# Altium project crossBarNIPCB_Project2.PrjPCB
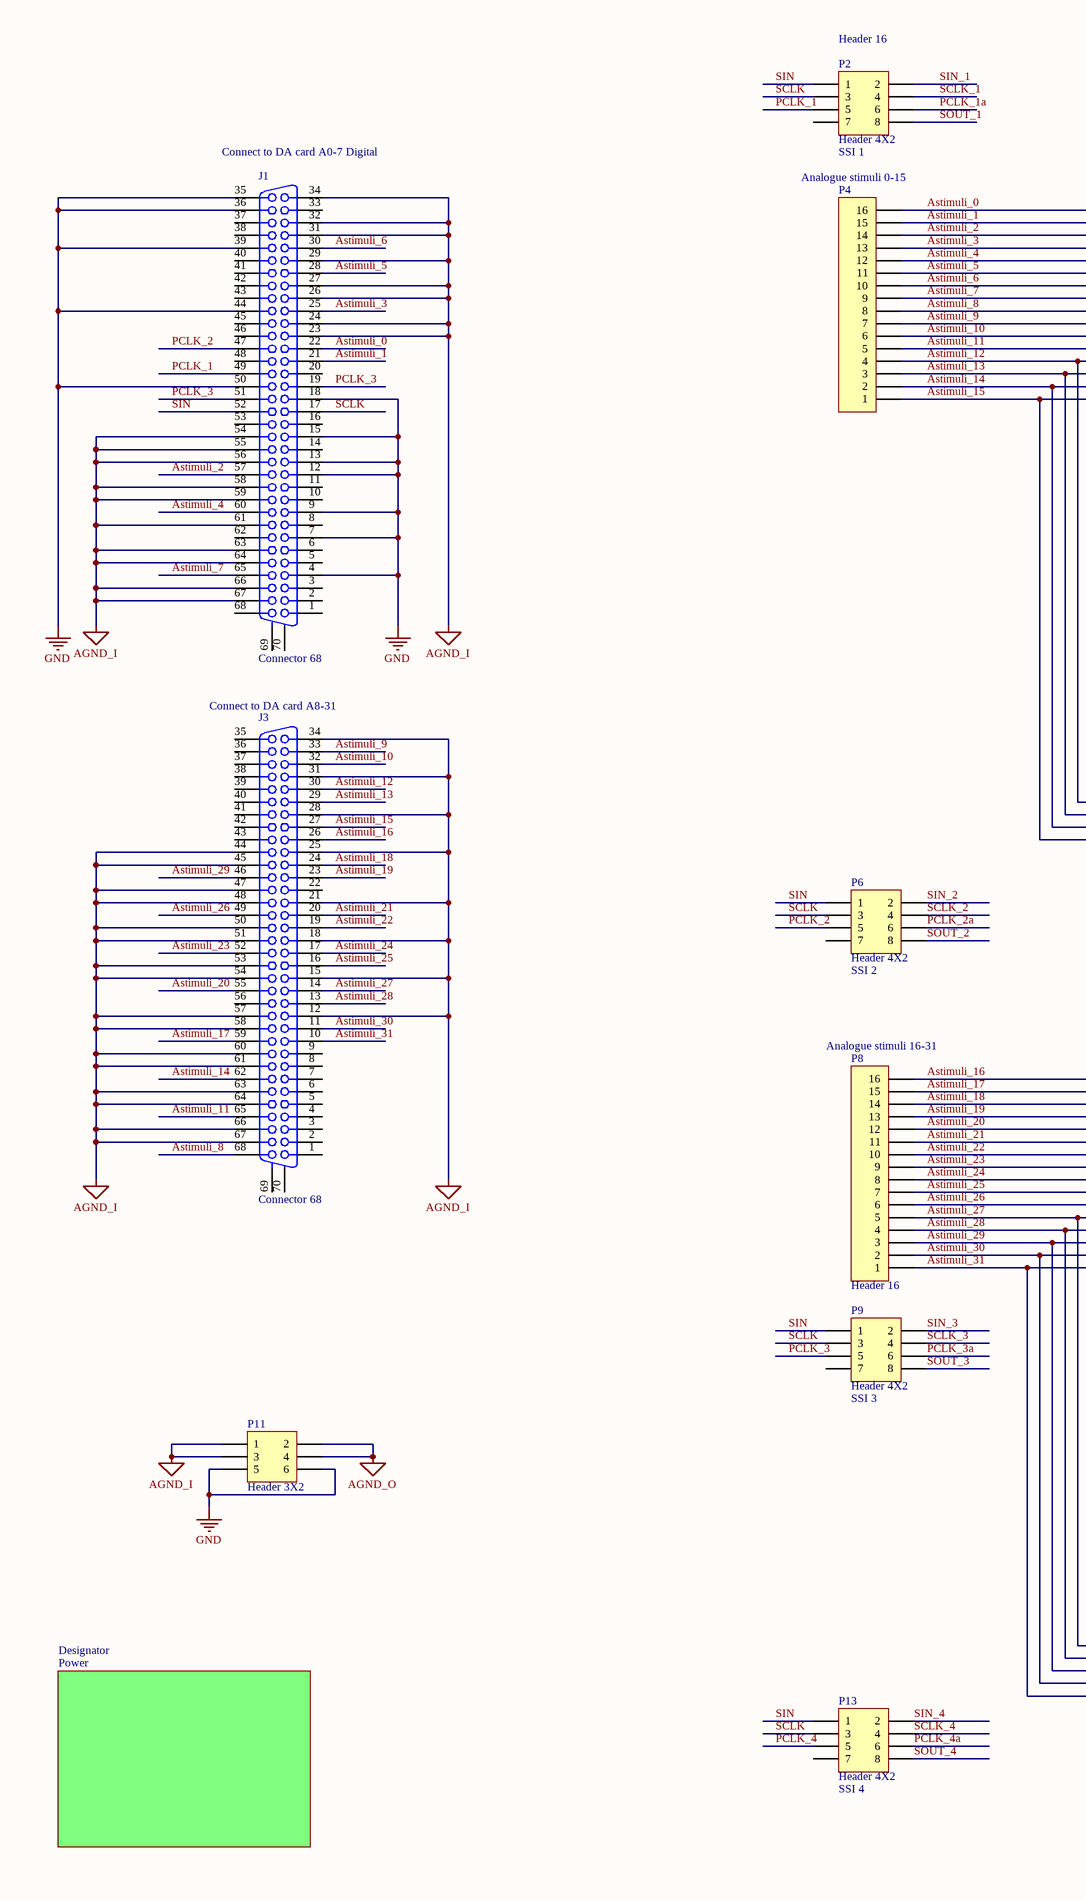
[diagram p0: Sheet1.SchDoc, left]
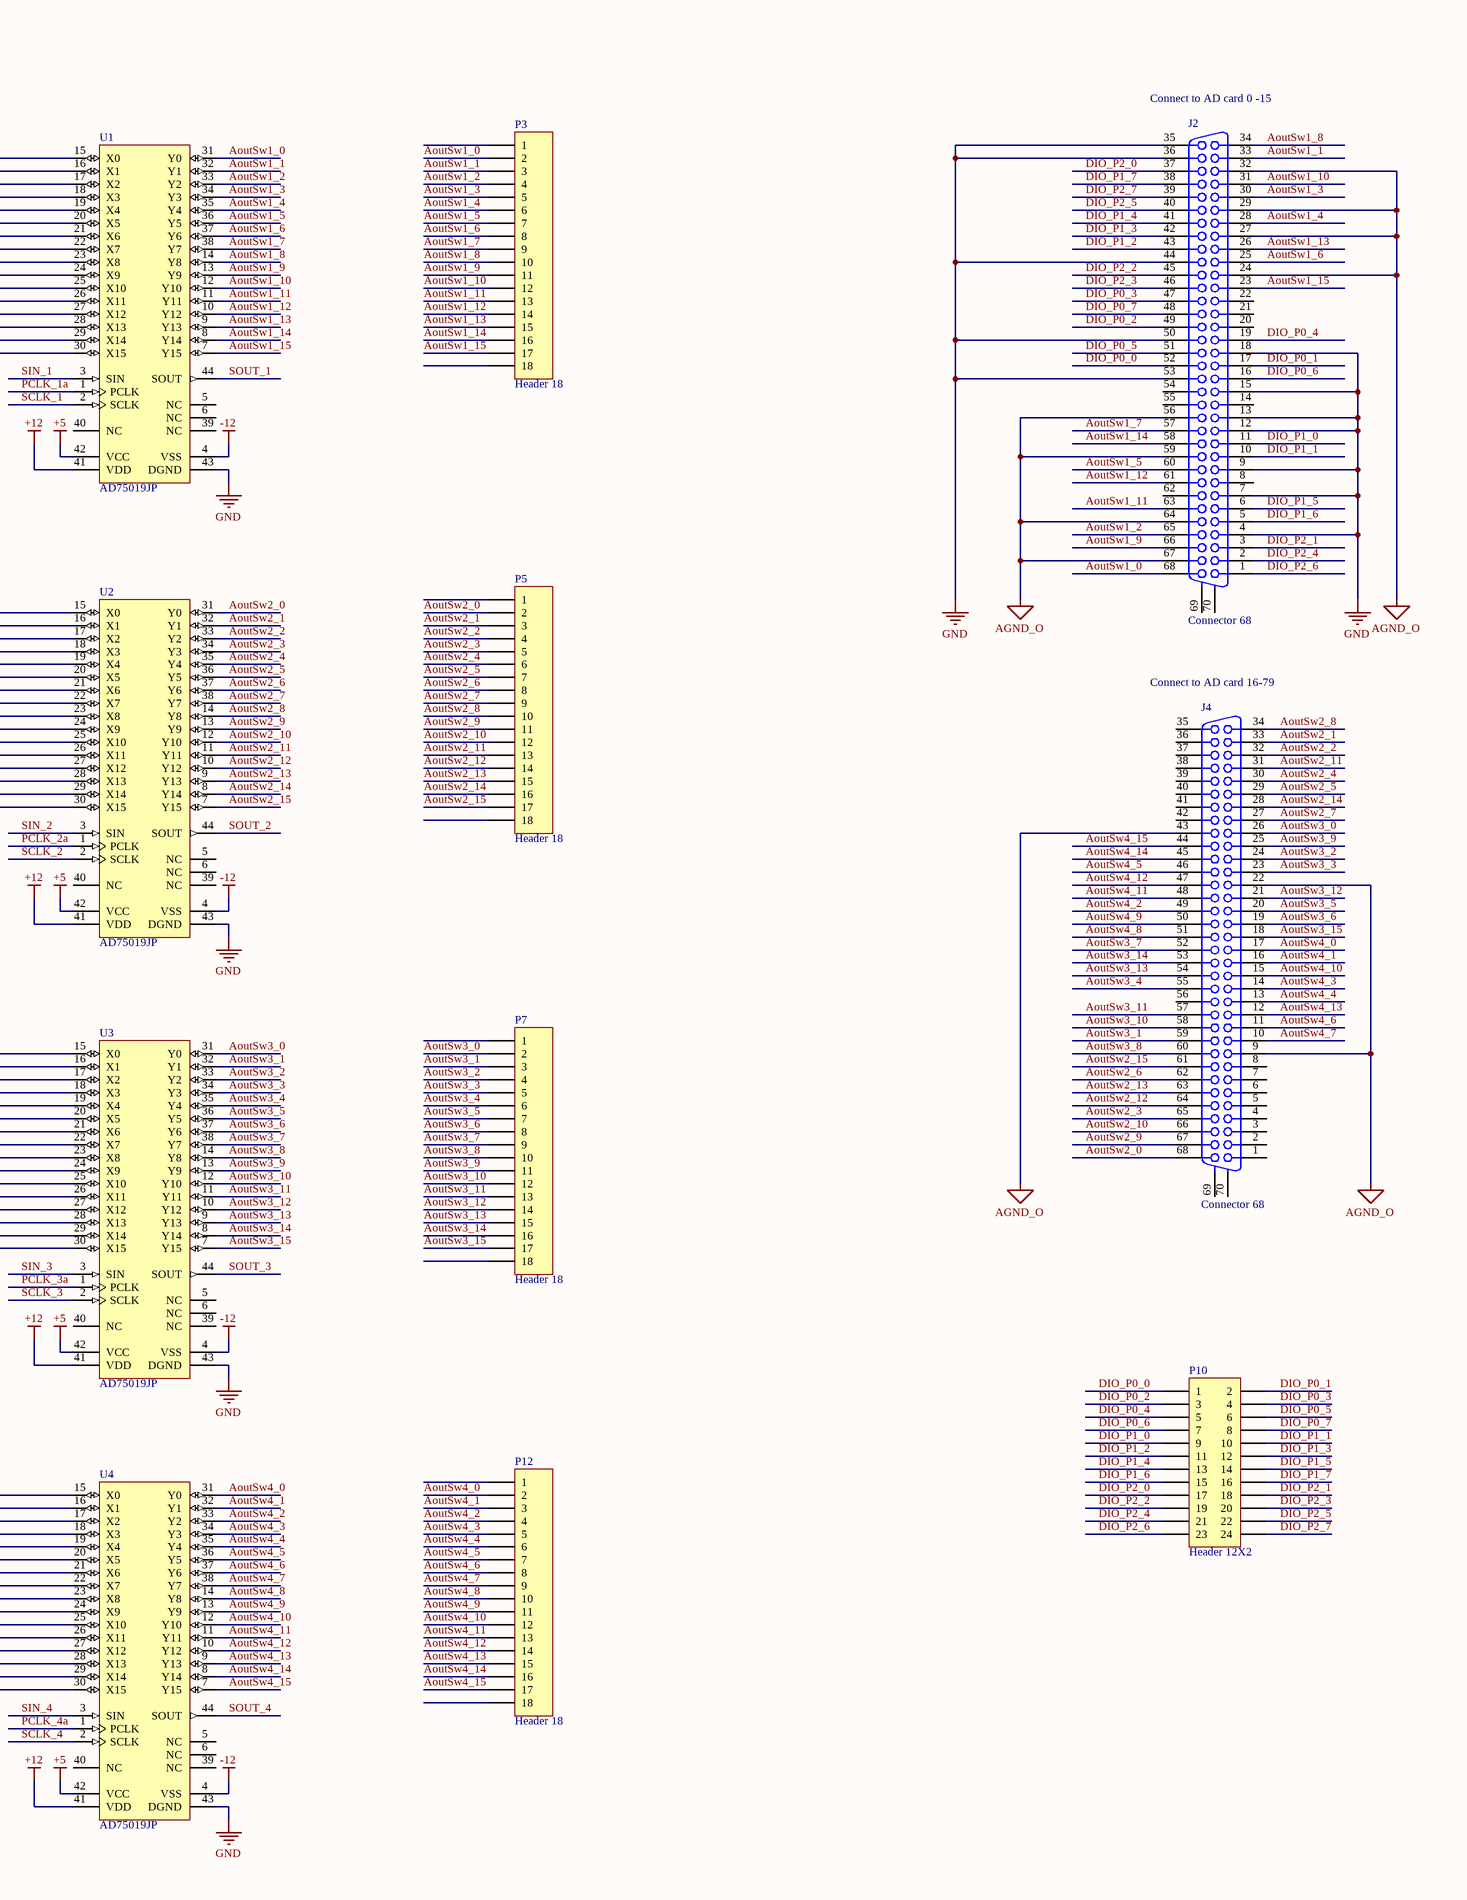
[diagram p1: Sheet1.SchDoc, right]
2 sheets, 41 parts. Net scope: global (net labels, ports and power ports of the same name join across sheets).
Board file: crossbarNI_PCB1.PcbDoc
Sheets:
  Sheet1.SchDoc
    Designator = Power.SchDoc

## Sheet Sheet1.SchDoc
size A2

### Parts
J1  Connector 68  [CHAMP1.27-2H68]
J2  Connector 68  [CHAMP1.27-2H68]
J3  Connector 68  [CHAMP1.27-2H68]
J4  Connector 68  [CHAMP1.27-2H68]
P2  Header 4X2  [HDR2X4]
P3  Header 18  [HDR1X18]
P4  Header 16  [HDR1X16]
P5  Header 18  [HDR1X18]
P6  Header 4X2  [HDR2X4]
P7  Header 18  [HDR1X18]
P8  Header 16  [HDR1X16]
P9  Header 4X2  [HDR2X4]
P10  Header 12X2  [HDR2X12]
P11  Header 3X2  [HDR2X3]
P12  Header 18  [HDR1X18]
P13  Header 4X2  [HDR2X4]
U1  AD75019JP  [ADI-P-44A_L]
U2  AD75019JP  [ADI-P-44A_N]
U3  AD75019JP  [ADI-P-44A_N]
U4  AD75019JP  [ADI-P-44A_N]

### Sub-sheets
Designator = Power: no entries

### Nets
+5: U1.42(VCC) U2.42(VCC) U3.42(VCC) U4.42(VCC)
+12: U1.41(VDD) U2.41(VDD) U3.41(VDD) U4.41(VDD)
-12: U1.4(VSS) U2.4(VSS) U3.4(VSS) U4.4(VSS)
AGND_I: J1.23 J1.24 J1.26 J1.27 J1.29 J1.31 J1.32 J1.34 J1.54 J1.55 J1.56 J1.58 J1.59 J1.61 J1.63 J1.64 J1.66 J1.67 J3.12 J3.15 J3.18 J3.21 J3.25 J3.28 J3.31 J3.34 J3.44 J3.45 J3.47 J3.48 J3.50 J3.51 J3.53 J3.54 J3.57 J3.58 J3.60 J3.61 J3.63 J3.64 J3.66 J3.67 P11.1 P11.3
AGND_O: J2.24 J2.27 J2.29 J2.32 J2.56 J2.59 J2.64 J2.67 J4.9 J4.22 J4.43 P11.2 P11.4
GND: J1.4 J1.7 J1.9 J1.12 J1.13 J1.15 J1.18 J1.35 J1.36 J1.39 J1.44 J1.50 J2.4 J2.7 J2.9 J2.12 J2.13 J2.15 J2.18 J2.35 J2.36 J2.44 J2.50 J2.53 P11.5 P11.6 U1.43(DGND) U2.43(DGND) U3.43(DGND) U4.43(DGND)
AoutSw1_0: J2.68 P3.2 U1.31(Y0)
AoutSw1_1: J2.33 P3.3 U1.32(Y1)
AoutSw1_2: J2.65 P3.4 U1.33(Y2)
AoutSw1_3: J2.30 P3.5 U1.34(Y3)
AoutSw1_4: J2.28 P3.6 U1.35(Y4)
AoutSw1_5: J2.60 P3.7 U1.36(Y5)
AoutSw1_6: J2.25 P3.8 U1.37(Y6)
AoutSw1_7: J2.57 P3.9 U1.38(Y7)
AoutSw1_8: J2.34 P3.10 U1.14(Y8)
AoutSw1_9: J2.66 P3.11 U1.13(Y9)
AoutSw1_10: J2.31 P3.12 U1.12(Y10)
AoutSw1_11: J2.63 P3.13 U1.11(Y11)
AoutSw1_12: J2.61 P3.14 U1.10(Y12)
AoutSw1_13: J2.26 P3.15 U1.9(Y13)
AoutSw1_14: J2.58 P3.16 U1.8(Y14)
AoutSw1_15: J2.23 P3.17 U1.7(Y15)
AoutSw2_0: J4.68 P5.2 U2.31(Y0)
AoutSw2_1: J4.33 P5.3 U2.32(Y1)
AoutSw2_2: J4.32 P5.4 U2.33(Y2)
AoutSw2_3: J4.65 P5.5 U2.34(Y3)
AoutSw2_4: J4.30 P5.6 U2.35(Y4)
AoutSw2_5: J4.29 P5.7 U2.36(Y5)
AoutSw2_6: J4.62 P5.8 U2.37(Y6)
AoutSw2_7: J4.27 P5.9 U2.38(Y7)
AoutSw2_8: J4.34 P5.10 U2.14(Y8)
AoutSw2_9: J4.67 P5.11 U2.13(Y9)
AoutSw2_10: J4.66 P5.12 U2.12(Y10)
AoutSw2_11: J4.31 P5.13 U2.11(Y11)
AoutSw2_12: J4.64 P5.14 U2.10(Y12)
AoutSw2_13: J4.63 P5.15 U2.9(Y13)
AoutSw2_14: J4.28 P5.16 U2.8(Y14)
AoutSw2_15: J4.61 P5.17 U2.7(Y15)
AoutSw3_0: J4.26 P7.2 U3.31(Y0)
AoutSw3_1: J4.59 P7.3 U3.32(Y1)
AoutSw3_2: J4.24 P7.4 U3.33(Y2)
AoutSw3_3: J4.23 P7.5 U3.34(Y3)
AoutSw3_4: J4.55 P7.6 U3.35(Y4)
AoutSw3_5: J4.20 P7.7 U3.36(Y5)
AoutSw3_6: J4.19 P7.8 U3.37(Y6)
AoutSw3_7: J4.52 P7.9 U3.38(Y7)
AoutSw3_8: J4.60 P7.10 U3.14(Y8)
AoutSw3_9: J4.25 P7.11 U3.13(Y9)
AoutSw3_10: J4.58 P7.12 U3.12(Y10)
AoutSw3_11: J4.57 P7.13 U3.11(Y11)
AoutSw3_12: J4.21 P7.14 U3.10(Y12)
AoutSw3_13: J4.54 P7.15 U3.9(Y13)
AoutSw3_14: J4.53 P7.16 U3.8(Y14)
AoutSw3_15: J4.18 P7.17 U3.7(Y15)
AoutSw4_0: J4.17 P12.2 U4.31(Y0)
AoutSw4_1: J4.16 P12.3 U4.32(Y1)
AoutSw4_2: J4.49 P12.4 U4.33(Y2)
AoutSw4_3: J4.14 P12.5 U4.34(Y3)
AoutSw4_4: J4.13 P12.6 U4.35(Y4)
AoutSw4_5: J4.46 P12.7 U4.36(Y5)
AoutSw4_6: J4.11 P12.8 U4.37(Y6)
AoutSw4_7: J4.10 P12.9 U4.38(Y7)
AoutSw4_8: J4.51 P12.10 U4.14(Y8)
AoutSw4_9: J4.50 P12.11 U4.13(Y9)
AoutSw4_10: J4.15 P12.12 U4.12(Y10)
AoutSw4_11: J4.48 P12.13 U4.11(Y11)
AoutSw4_12: J4.47 P12.14 U4.10(Y12)
AoutSw4_13: J4.12 P12.15 U4.9(Y13)
AoutSw4_14: J4.45 P12.16 U4.8(Y14)
AoutSw4_15: J4.44 P12.17 U4.7(Y15)
Astimuli_0: J1.22 P4.16 U1.15(X0) U2.15(X0)
Astimuli_1: J1.21 P4.15 U1.16(X1) U2.16(X1)
Astimuli_2: J1.57 P4.14 U1.17(X2) U2.17(X2)
Astimuli_3: J1.25 P4.13 U1.18(X3) U2.18(X3)
Astimuli_4: J1.60 P4.12 U1.19(X4) U2.19(X4)
Astimuli_5: J1.28 P4.11 U1.20(X5) U2.20(X5)
Astimuli_6: J1.30 P4.10 U1.21(X6) U2.21(X6)
Astimuli_7: J1.65 P4.9 U1.22(X7) U2.22(X7)
Astimuli_8: J3.68 P4.8 U1.23(X8) U2.23(X8)
Astimuli_9: J3.33 P4.7 U1.24(X9) U2.24(X9)
Astimuli_10: J3.32 P4.6 U1.25(X10) U2.25(X10)
Astimuli_11: J3.65 P4.5 U1.26(X11) U2.26(X11)
Astimuli_12: J3.30 P4.4 U1.27(X12) U2.27(X12)
Astimuli_13: J3.29 P4.3 U1.28(X13) U2.28(X13)
Astimuli_14: J3.62 P4.2 U1.29(X14) U2.29(X14)
Astimuli_15: J3.27 P4.1 U1.30(X15) U2.30(X15)
Astimuli_16: J3.26 P8.16 U3.15(X0) U4.15(X0)
Astimuli_17: J3.59 P8.15 U3.16(X1) U4.16(X1)
Astimuli_18: J3.24 P8.14 U3.17(X2) U4.17(X2)
Astimuli_19: J3.23 P8.13 U3.18(X3) U4.18(X3)
Astimuli_20: J3.55 P8.12 U3.19(X4) U4.19(X4)
Astimuli_21: J3.20 P8.11 U3.20(X5) U4.20(X5)
Astimuli_22: J3.19 P8.10 U3.21(X6) U4.21(X6)
Astimuli_23: J3.52 P8.9 U3.22(X7) U4.22(X7)
Astimuli_24: J3.17 P8.8 U3.23(X8) U4.23(X8)
Astimuli_25: J3.16 P8.7 U3.24(X9) U4.24(X9)
Astimuli_26: J3.49 P8.6 U3.25(X10) U4.25(X10)
Astimuli_27: J3.14 P8.5 U3.26(X11) U4.26(X11)
Astimuli_28: J3.13 P8.4 U3.27(X12) U4.27(X12)
Astimuli_29: J3.46 P8.3 U3.28(X13) U4.28(X13)
Astimuli_30: J3.11 P8.2 U3.29(X14) U4.29(X14)
Astimuli_31: J3.10 P8.1 U3.30(X15) U4.30(X15)
DIO_P0_0: J2.52 P10.1
DIO_P0_1: J2.17 P10.2
DIO_P0_2: J2.49 P10.3
DIO_P0_3: J2.47 P10.4
DIO_P0_4: J2.19 P10.5
DIO_P0_5: J2.51 P10.6
DIO_P0_6: J2.16 P10.7
DIO_P0_7: J2.48 P10.8
DIO_P1_0: J2.11 P10.9
DIO_P1_1: J2.10 P10.10
DIO_P1_2: J2.43 P10.11
DIO_P1_3: J2.42 P10.12
DIO_P1_4: J2.41 P10.13
DIO_P1_5: J2.6 P10.14
DIO_P1_6: J2.5 P10.15
DIO_P1_7: J2.38 P10.16
DIO_P2_0: J2.37 P10.17
DIO_P2_1: J2.3 P10.18
DIO_P2_2: J2.45 P10.19
DIO_P2_3: J2.46 P10.20
DIO_P2_4: J2.2 P10.21
DIO_P2_5: J2.40 P10.22
DIO_P2_6: J2.1 P10.23
DIO_P2_7: J2.39 P10.24
PCLK_1: J1.49 P2.5
PCLK_1a: P2.6 U1.1(PCLK)
PCLK_2: J1.47 P6.5
PCLK_2a: P6.6 U2.1(PCLK)
PCLK_3: J1.19 J1.51 P9.5
PCLK_3a: P9.6 U3.1(PCLK)
PCLK_4: P13.5
PCLK_4a: P13.6 U4.1(PCLK)
SCLK: J1.17 P2.3 P6.3 P9.3 P13.3
SCLK_1: P2.4 U1.2(SCLK)
SCLK_2: P6.4 U2.2(SCLK)
SCLK_3: P9.4 U3.2(SCLK)
SCLK_4: P13.4 U4.2(SCLK)
SIN: J1.52 P2.1 P6.1 P9.1 P13.1
SIN_1: P2.2 U1.3(SIN)
SIN_2: P6.2 U2.3(SIN)
SIN_3: P9.2 U3.3(SIN)
SIN_4: P13.2 U4.3(SIN)
SOUT_1: P2.8 U1.44(SOUT)
SOUT_2: P6.8 U2.44(SOUT)
SOUT_3: P9.8 U3.44(SOUT)
SOUT_4: P13.8 U4.44(SOUT)

Not connected (* = marked no-connect by the designer): J1 1 2 3 5 6 8 10 11 14 16 20 33 37 38 40 41 42 43 45 46 48 53 62 68 69(MH1) 70(MH2); J2 8 14 20 21 22 54 55 62 69(MH1) 70(MH2); J3 1 2 3 4 5 6 7 8 9 22 35 36 37 38 39 40 41 42 43 56 69(MH1) 70(MH2); J4 1 2 3 4 5 6 7 8 35 36 37 38 39 40 41 42 56 69(MH1) 70(MH2); P2 7; P3 1 18; P5 1 18; P6 7; P7 1 18; P9 7; P12 1 18; P13 7; U1 5(NC) 6(NC) 39(NC) 40(NC); U2 5(NC) 6(NC) 39(NC) 40(NC); U3 5(NC) 6(NC) 39(NC) 40(NC); U4 5(NC) 6(NC) 39(NC) 40(NC)

### Notes on the sheet
- (near J1) Connect to DA card A0-7 Digital
- (near P2) SSI 1
- (near J2) Connect to AD card 0 -15
- (near P4) Analogue stimuli 0-15
- (near J3) Connect to DA card A8-31
- (near J4) Connect to AD card 16-79
- (near P6) SSI 2
- (near P8) Analogue stimuli 16-31
- (near P9) SSI 3
- (near P13) SSI 4

### Library data of the parts
J1-J4 = Connector 68: Receptacle Header Assemby; PackageDocument: B; Positions: 68; Published: 15-Jun-2001; LatestRevisionDate: 17-Jul-2002; LatestRevisionNote: Re-released for DXP Platform.; DatasheetDocument: 1-Oct-1983; PackageReference: 178240-8; Publisher: Altium Limited; Orientation: Right Angle
P2 P6 P9 P13 = Header 4X2: Header, 4-Pin, Dual row; LatestRevisionDate: 17-Jul-2002; LatestRevisionNote: Re-released for DXP Platform.; Publisher: Altium Limited
P3 P5 P7 P12 = Header 18: Header, 18-Pin; LatestRevisionDate: 17-Jul-2002; LatestRevisionNote: Re-released for DXP Platform.; Publisher: Altium Limited
P4 P8 = Header 16: Header, 16-Pin; LatestRevisionDate: 17-Jul-2002; LatestRevisionNote: Re-released for DXP Platform.; Publisher: Altium Limited
P10 = Header 12X2: Header, 12-Pin, Dual row; LatestRevisionDate: 17-Jul-2002; LatestRevisionNote: Re-released for DXP Platform.; Publisher: Altium Limited
P11 = Header 3X2: Header, 3-Pin, Dual row; LatestRevisionDate: 17-Jul-2002; LatestRevisionNote: Re-released for DXP Platform.; Publisher: Altium Limited
U1-U4 = CMP-0788-00031-1: 16 x 16 Crosspoint Switch Array, +/-12 V Supply, 44-pin LCC (P-44A), Tube; Manufacturer: Analog Devices; Control Interface: Serial; Slew Rate (V/us): n / a; Output Buffer: No; Small Signal BW (MHz): 20; PackageReference: P-44A; ComponentLink2URL: http://www.analog.com/static/imported-files/data_sheets/AD75019.pdf; ComponentLink1Description: Manufacturer URL; Mounting Technology: Surface Mount; DatasheetVersion: Rev. C; PackageDescription: 44-Pin Plastic Leaded Chip Carrier, Body 16.59 x 16.59 mm, Pitch 1.27 mm; PackageVersion: Jan-03; Code_JEDEC: MO-047AC; Supply Voltage (V): +/-12; PartNumber: AD75019JP; ComponentLink1URL: http://www.analog.com/en/index.html; ComponentLink3URL: http://www.analog.com/static/imported-files/packages/533756178731793364534243243792136664964P44A.pdf; ComponentLink2Description: Datasheet; Packing: Tube; ComponentLink3Description: Package Specification

## Sheet Power.SchDoc
size A4
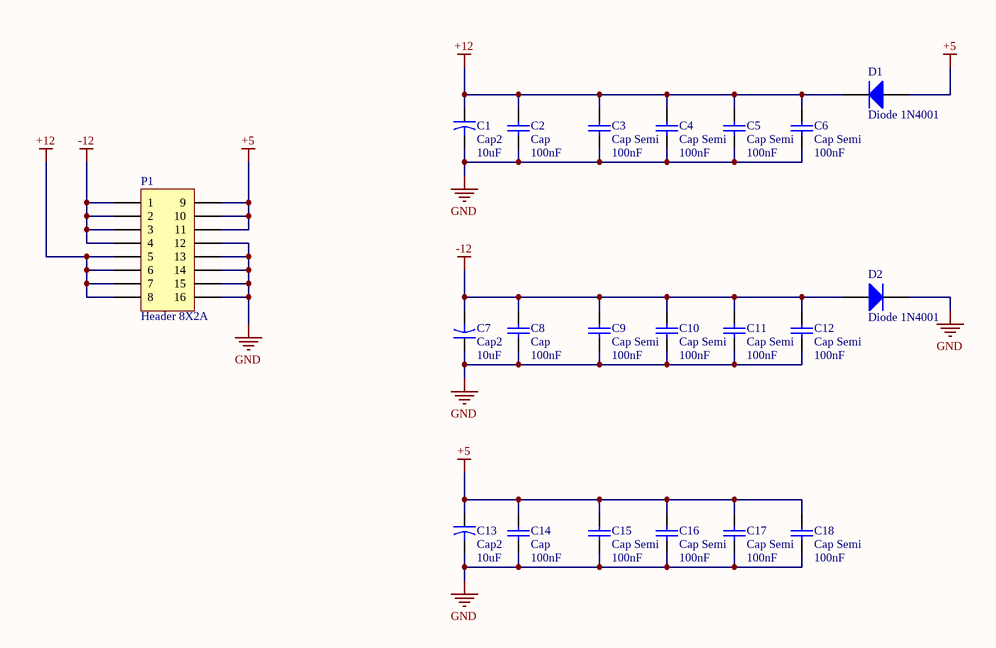
[diagram p2: Power.SchDoc]

### Parts
C1  Cap2  value 10uF  [CAPR5-4X5]
C2  Cap  value 100nF  [RAD-0.3]
C3  Cap Semi  value 100nF  [C1206]
C4  Cap Semi  value 100nF  [C1206]
C5  Cap Semi  value 100nF  [C1206]
C6  Cap Semi  value 100nF  [C1206]
C7  Cap2  value 10uF  [CAPR5-4X5]
C8  Cap  value 100nF  [RAD-0.3]
C9  Cap Semi  value 100nF  [C1206]
C10  Cap Semi  value 100nF  [C1206]
C11  Cap Semi  value 100nF  [C1206]
C12  Cap Semi  value 100nF  [C1206]
C13  Cap2  value 10uF  [CAPR5-4X5]
C14  Cap  value 100nF  [RAD-0.3]
C15  Cap Semi  value 100nF  [C1206]
C16  Cap Semi  value 100nF  [C1206]
C17  Cap Semi  value 100nF  [C1206]
C18  Cap Semi  value 100nF  [C1206]
D1  Diode 1N4001  [DO-41]
D2  Diode 1N4001  [DO-41]
P1  Header 8X2A  [HDR2X8_CEN]

### Nets
+5: C13.1 C14.2 C15.1 C16.1 C17.1 C18.1 D1.1(A) P1.9 P1.10 P1.11
+12: C1.1 C2.2 C3.1 C4.1 C5.1 C6.1 D1.2(K) P1.5 P1.6 P1.7 P1.8
-12: C7.2 C8.2 C9.1 C10.1 C11.1 C12.1 D2.1(A) P1.1 P1.2 P1.3 P1.4
GND: C1.2 C2.1 C3.2 C4.2 C5.2 C6.2 C7.1 C8.1 C9.2 C10.2 C11.2 C12.2 C13.2 C14.1 C15.2 C16.2 C17.2 C18.2 D2.2(K) P1.12 P1.13 P1.14 P1.15 P1.16

### Library data of the parts
C1 C7 C13 = Cap2: Capacitor; Published: 23-Sep-2002; PackageReference: CAPR5-4X5; Publisher: Altium Limited; PackageDescription: Capacitor; 2 Leads
C2 C8 C14 = Cap: Capacitor; Published: 8-Jun-2000; LatestRevisionDate: 17-Jul-2002; LatestRevisionNote: Re-released for DXP Platform.; PackageReference: RAD-0.3; Publisher: Altium Limited; PackageDescription: Radial Cap, Thru-Hole; 2 Leads; 0.3 in Pin Spacing
C3-C6 C9-C12 C15-C18 = Cap Semi: Capacitor (Semiconductor SIM Model); Published: 8-Jun-2000; LatestRevisionDate: 29-May-2009; LatestRevisionNote: IPC-7351 Footprint Added.; PackageReference: C1206; Publisher: Altium Limited; PackageDescription: Chip Capacitor
D1 D2 = Diode 1N4001: 1 Amp General Purpose Rectifier; Published: 8-Jun-2000; LatestRevisionDate: 17-Jul-2002; LatestRevisionNote: Re-released for DXP Platform.; DatasheetVersion: 1998; PackageVersion: Aug-1999; PackageReference: DO-41; Publisher: Altium Limited; PackageDescription: Diode, Axial; Body 5.2 x 2.7 mm (LxDia. max), Lead Dia. 0.86 mm (max); Code_JEDEC: DO-204-AL; ComponentLink1Description: Manufacturer Link; ComponentLink1URL: http://www.fairchildsemi.com/; ComponentLink2Description: Datasheet; ComponentLink2URL: http://www.fairchildsemi.com/ds/1N%2F1N4001.pdf
P1 = Header 8X2A: Header, 8-Pin, Dual row; LatestRevisionDate: 17-Jul-2002; LatestRevisionNote: Re-released for DXP Platform.; Publisher: Altium Limited

## Nets that join several sheets
+5: Sheet1 (U1.42 U2.42 U3.42 U4.42), Power (10 pins)
+12: Sheet1 (U1.41 U2.41 U3.41 U4.41), Power (11 pins)
-12: Sheet1 (U1.4 U2.4 U3.4 U4.4), Power (11 pins)
GND: Sheet1 (30 pins), Power (24 pins)